# Altium project TMDX654GPEVM.PrjPcb (part 18 of 24)

## Sheet 39-VOLTAGE SUPERVISOR AND WKUP LEDs.SchDoc
size 513 x 386 mm
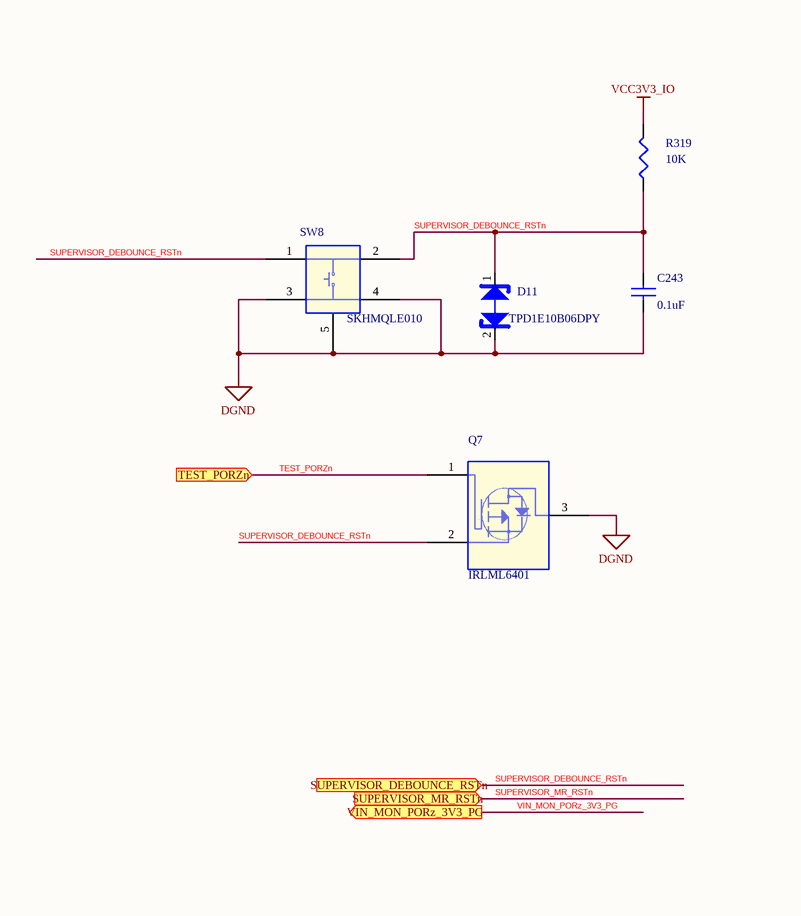
[diagram p72: 39-VOLTAGE SUPERVISOR AND WKUP LEDs.SchDoc, left]
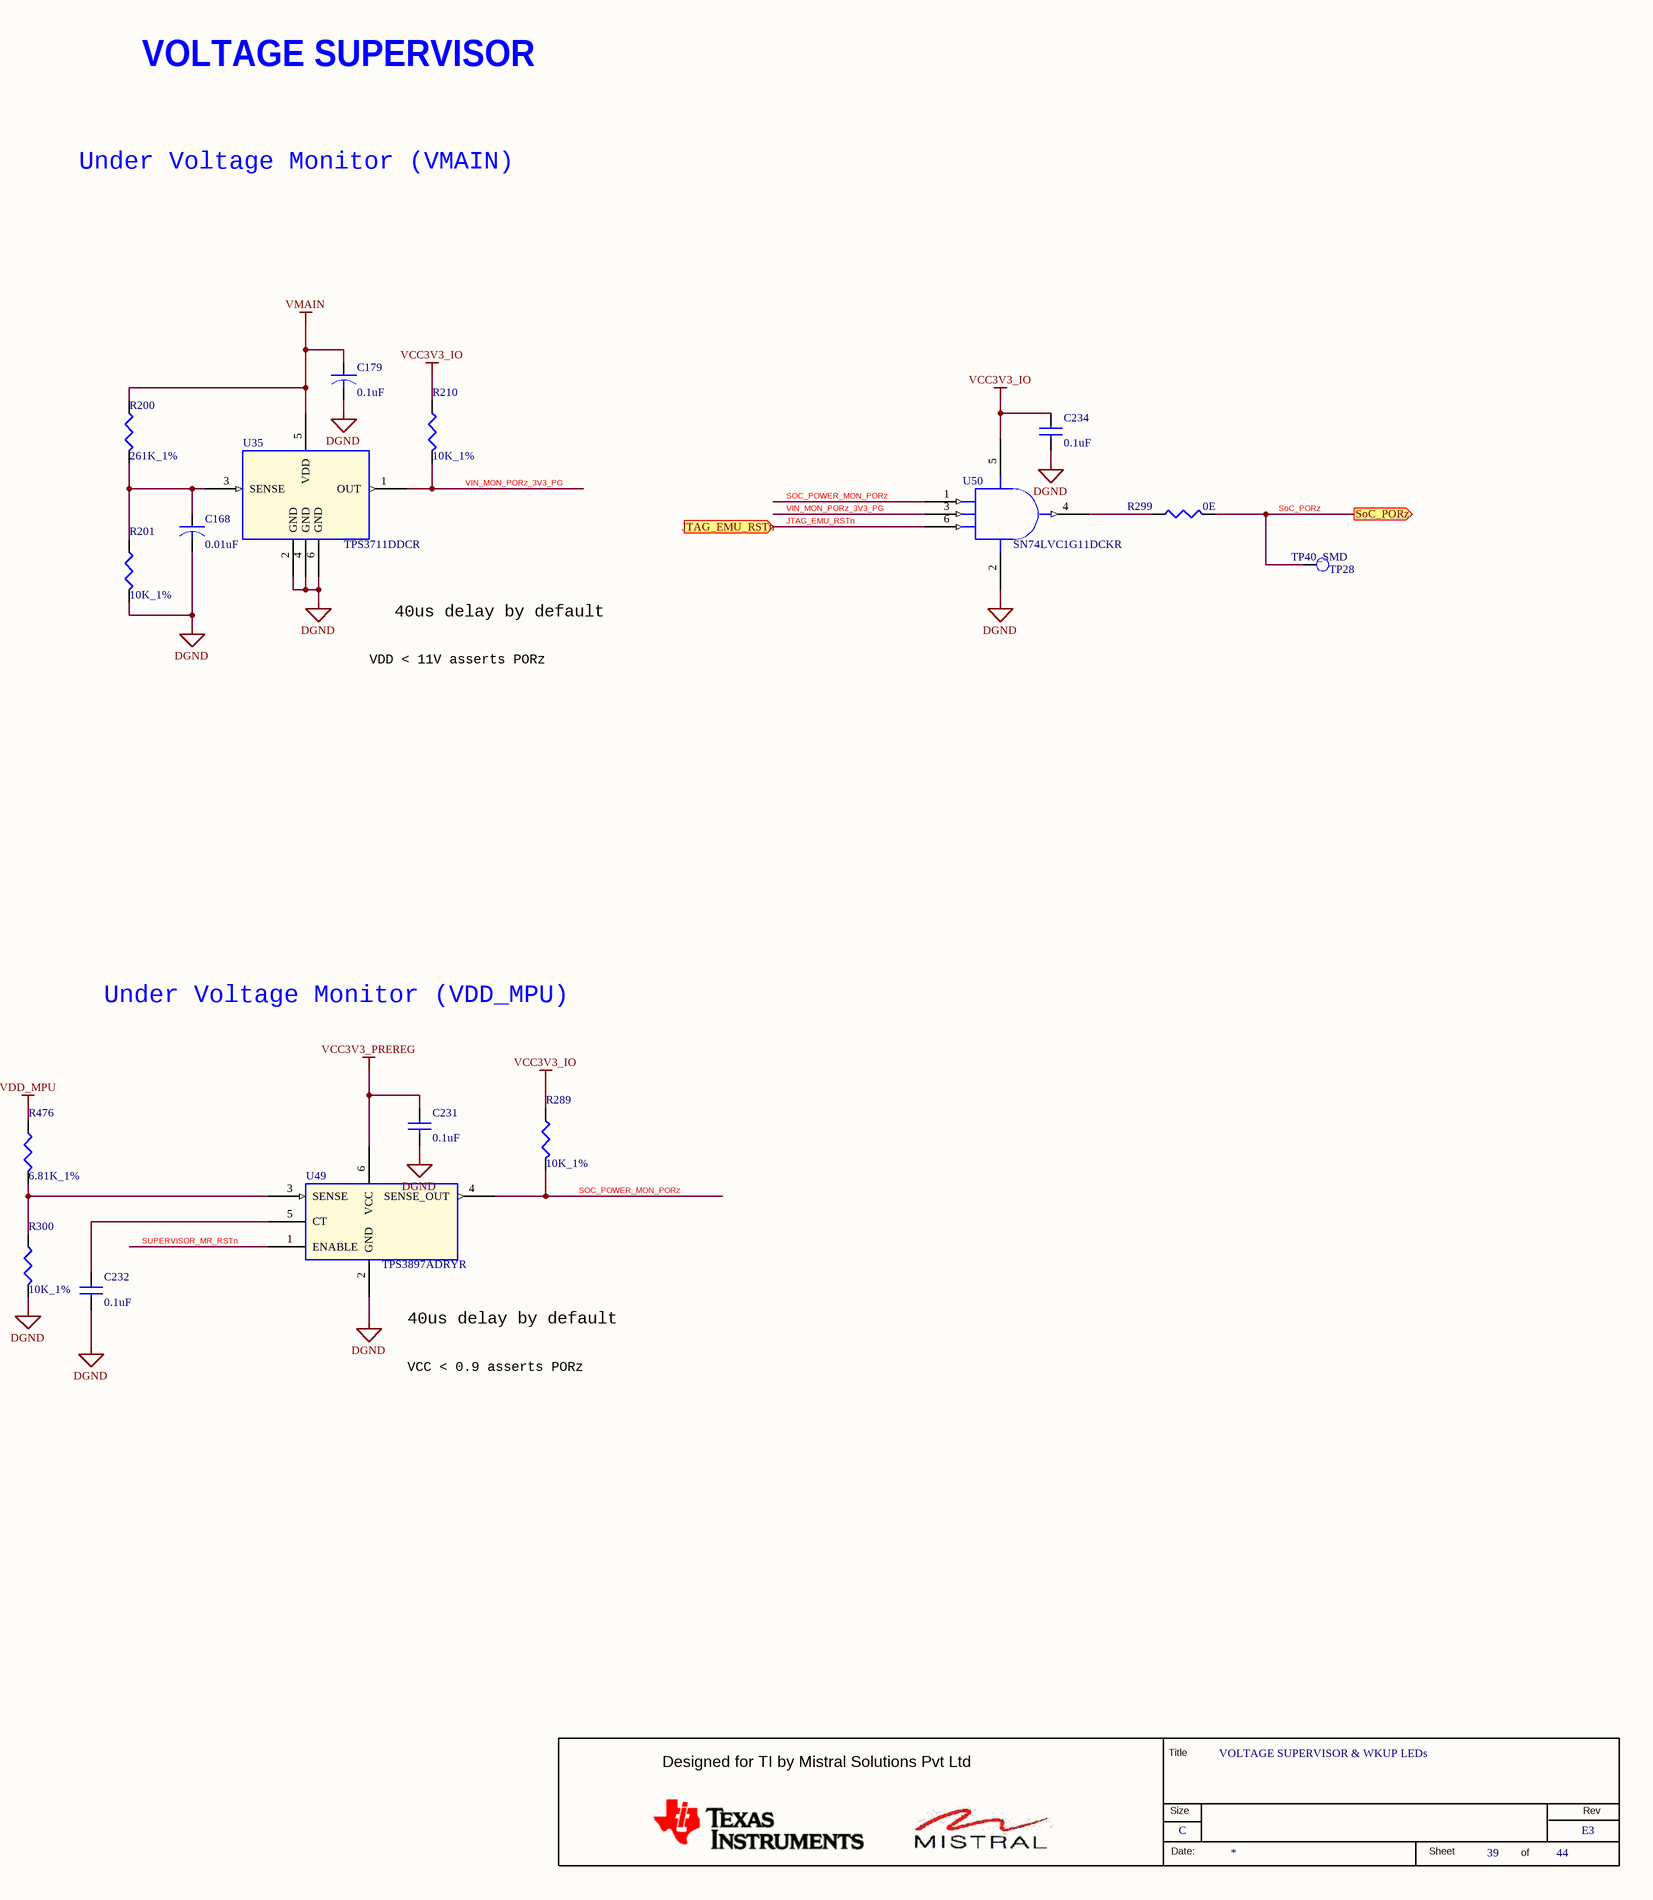
[diagram p73: 39-VOLTAGE SUPERVISOR AND WKUP LEDs.SchDoc, right]

### Parts
(Parts that share a designator on the sheet are numbered #1, #2 ... from top to bottom, then left to right.)
*#39  RevCode: E3  Title: VOLTAGE SUPERVISOR & WKUP LEDs  Page Size: C  Page Number: 39  Page Count: 44  (hidden comment: MISTRAL_TITLEBLK_CSIZE)  (graphical)
C168  0.01uF  [CAP0201_0-5]
C179  0.1uF  [CAP0603_1]
C231  0.1uF  [CAP0201_0-5]
C232  0.1uF  [CAP0201_0-5]
C234  0.1uF  [CAP0201_0-5]
C243  0.1uF  [CAP0201_0-5]
D11  TPD1E10B06DPY  [DIO_DFN0402]
Q7  IRLML6401  [TO_SOT23-123]
R200  261K_1%  [RES0402_0-5]
R201  10K_1%  [RES0402_0-5]
R210  10K_1%  [RES0402_0-5]
R289  10K_1%  [RES0402_0-5]
R299  0E  [RES0402_0-5]
R300  10K_1%  [RES0402_0-5]
R319  10K  [RES0402_0-5]
R476  6.81K_1%  [RES0402_0-5]
SW8  SKHMQLE010  [SW4_SKHMQLE010_240X260_SMD_3-1]
TP28  TP40_SMD  [TP40_SMD]
U35  TPS3711DDCR  [SOT23-6_1-1]
U49  TPS3897ADRYR  [SON6_19-68_40X60_0-6]
U50  SN74LVC1G11DCKR  [SC70-6]

### Ports
JTAG_EMU_RSTn (in), SoC_PORz (out), SUPERVISOR_DEBOUNCE_RSTn (in), SUPERVISOR_MR_RSTn (in), TEST_PORZn (in), VIN_MON_PORz_3V3_PG (out)

### Nets
DGND: C168.2 C179.2 C231.2 C232.2 C234.2 C243.2 D11.2(A) Q7.3(D) R201.2 R300.2 SW8.3 SW8.4 SW8.5(GND) U35.2(GND) U35.4(GND) U35.6(GND) U49.2(GND) U50.2(GND)
VCC3V3_IO: C234.1 R210.1 R289.1 R319.2 U50.5(VCC)
VCC3V3_PREREG: C231.1 U49.6(VCC)
VDD_MPU: R476.1
VMAIN: C179.1 R200.1 U35.5(VDD)
JTAG_EMU_RSTn: U50.6(C) ; port JTAG_EMU_RSTn
SoC_PORz: R299.2 TP28.1(TP) ; port SoC_PORz
SOC_POWER_MON_PORz: R289.2 U49.4(SENSE_OUT) U50.1(A)
SUPERVISOR_DEBOUNCE_RSTn: C243.1 D11.1(K) Q7.2(S) R319.1 SW8.1 SW8.2 ; port SUPERVISOR_DEBOUNCE_RSTn
SUPERVISOR_MR_RSTn: U49.1(ENABLE) ; port SUPERVISOR_MR_RSTn
TEST_PORZn: Q7.1(G) ; port TEST_PORZn
VIN_MON_PORz_3V3_PG: R210.2 U35.1(OUT) U50.3(B) ; port VIN_MON_PORz_3V3_PG
NetC168_1: C168.1 R200.2 R201.1 U35.3(SENSE)
NetC232_1: C232.1 U49.5(CT)
NetR299_1: R299.1 U50.4(Y)
NetR300_1: R300.1 R476.2 U49.3(SENSE)

### Notes on the sheet
- VOLTAGE SUPERVISOR
- Under Voltage Monitor (VMAIN)
- 40us delay by default
- VDD < 11V asserts PORz
- Under Voltage Monitor (VDD_MPU)
- VCC < 0.9 asserts PORz
- (in symbol MISTRAL_TITLEBLK_CSIZE) Title; Designed for TI by Mistral Solutions Pvt Ltd; Size; Rev; Date:; Sheet; of

### Library data of the parts
*#39 = MISTRAL_TITLEBLK_CSIZE: Issue: 1.0; Page Create Date: March  8, 1995; Page Modify Date: *
C168 = CAP: CAP CERAMIC 0.01uF 25V 10% X5R 0201; Mistral Part No: 120018010007-R; Mfr_name: MURATA; Mfr_part_number: GRM033R61E103KA12J; Part_type: CAPACITORS\CERAMIC; Project: TI_MAXIE_CPB; Wattage: NA; Customs_HS_Code: 85322990; Custom_Duty: 15%; Library Ref: CAP; Tolerance: 10%; Voltage: 25V; Package: 0201; Distributor_name: DIGIKEY; Distributor_part_number: GRM033R61E103KA12J-ND; Height: 0.33MM; Weight: 0.33mg; Temperature: -55°C+85°C; Datasheet: Y:\MIS_DATABASE\DATASHEETS\CAPACITORS\GRM033R61E103KA12.PDF; Crtd /date: MANIRAJA/230118; Chkd/date: MANIRAJA/230118; MECHANICAL 3D STEP FILE: CAP0201_0-5; PCB Footprint: CAP0201_0-5
C179 = CAP_Dup1: CAP CERAMIC 0.1uF 50V 20% X7R 0603; Mistral Part No: 120018010021-R; Mfr_name: KEMET; Mfr_part_number: C0603C104M5RACTU; Part_type: CAPACITORS\CERAMIC; Project: TI_MAXIE_CPB; Wattage: NA; Customs_HS_Code: 85322990; Custom_Duty: 15%; Library Ref: CAP; MECHANICAL 3D STEP FILE: CAP0603_1; Tolerance: 20%; Voltage: 50V; Package: 0603; Distributor_name: DIGIKEY; Distributor_part_number: 399-7845-1-ND; Height: 0.95MM; Weight: 2mg; Temperature: -55°C+125°C; Datasheet: Y:\MIS_DATABASE\DATASHEETS\CAPACITORS\KEMET-X7R-SER.PDF; Crtd /date: MANIRAJA/240118; Chkd/date: MANIRAJA/240118; PCB Footprint: CAP0603_1
C231 = CAP_Dup4: CAP CERAMIC 0.1uF 16V 10% X5R 0201; Part_type: CAPACITORS\CERAMIC; Mfr_part_number: GRM033R61C104KE84J; Mfr_name: MURATA; Mistral Part No: 120009030072-R; Custom_Duty: 15%; Customs_HS_Code: 85322990; Wattage: NA; Project: TI_MAXIE_CPB; Library Ref: CAP; Chkd/date: MANIRAJA/120218; Crtd /date: MANIRAJA/120218; Datasheet: Y:\MIS_DATABASE\DATASHEETS\CAPACITORS\GRM033R61C104KE84.PDF; Weight: 0.33mg; Height: 0.33MM; Distributor_part_number: 490-16742-1-ND; Distributor_name: DIGIKEY; Package: 0201; Voltage: 16V; Tolerance: 10%; Temperature: -55°C+85°C; MECHANICAL 3D STEP FILE: CAP0201_0-5; PCB Footprint: CAP0201_0-5
C232 = CAP_Dup4: CAP CERAMIC 0.1uF 16V 10% X5R 0201; Part_type: CAPACITORS\CERAMIC; Mfr_part_number: GRM033R61C104KE84J; Mfr_name: MURATA; Mistral Part No: 120009030072-R; Custom_Duty: 15%; Customs_HS_Code: 85322990; Wattage: NA; Project: TI_MAXIE_CPB; NI_MARK: DNI; Library Ref: CAP; Chkd/date: MANIRAJA/120218; Crtd /date: MANIRAJA/120218; Datasheet: Y:\MIS_DATABASE\DATASHEETS\CAPACITORS\GRM033R61C104KE84.PDF; Weight: 0.33mg; Height: 0.33MM; Distributor_part_number: 490-16742-1-ND; Distributor_name: DIGIKEY; Package: 0201; Voltage: 16V; Tolerance: 10%; Temperature: -55°C+85°C; MECHANICAL 3D STEP FILE: CAP0201_0-5; PCB Footprint: CAP0201_0-5
C234 = CAP_Dup4: CAP CERAMIC 0.1uF 16V 10% X5R 0201; Mistral Part No: 120009030072-R; Mfr_name: MURATA; Mfr_part_number: GRM033R61C104KE84J; Part_type: CAPACITORS\CERAMIC; Project: TI_MAXIE_CPB; Wattage: NA; Customs_HS_Code: 85322990; Custom_Duty: 15%; Library Ref: CAP; Tolerance: 10%; Voltage: 16V; Package: 0201; Distributor_name: DIGIKEY; Distributor_part_number: 490-16742-1-ND; Height: 0.33MM; Weight: 0.33mg; Datasheet: Y:\MIS_DATABASE\DATASHEETS\CAPACITORS\GRM033R61C104KE84.PDF; Crtd /date: MANIRAJA/120218; Chkd/date: MANIRAJA/120218; Temperature: -55°C+85°C; MECHANICAL 3D STEP FILE: CAP0201_0-5; PCB Footprint: CAP0201_0-5
C243 = CAP_Dup5: as C160 on sheet 36-ETHERNET PHY CLOCK GENERATOR; Library Ref: CAP; PCB Footprint: CAP0201_0-5; MECHANICAL 3D STEP FILE: CAP0201_0-5; Chkd/date: MANIRAJA/120218; Crtd /date: MANIRAJA/120218; Datasheet: Y:\MIS_DATABASE\DATASHEETS\CAPACITORS\GRM033R61C104KE84.PDF; Temperature: -55°C+85°C; Weight: 0.33mg; Height: 0.33MM; Distributor_part_number: 490-16742-1-ND; Distributor_name: DIGIKEY; Package: 0201; Voltage: 16V; Tolerance: 10%
D11 = DIODE_PESD: DIODE 1CH ESD PROTECTION SMD(0402); Mistral Part No: 130014110022-R; Mfr_name: TEXAS INSTRUMENTS; Part_type: DIODE\MISC; Project: GALILEO_EVM; Tolerance: NA; Customs_HS_Code: 85423100; Custom_Duty: 15%; Library Ref: DIODE_PESD; Mfr_part_number: TPD1E10B06DPY; Voltage: NA; Wattage: NA; Package: SMD; Distributor_name: DIGIKEY; Distributor_part_number: 296-30406-1-ND; Height: 0.45MM; Weight: NA; Temperature: -40°C+125°C; Datasheet: Y:\MIS_DATABASE\DATASHEETS\ICS\INTERFACE\TPD1E10B06.PDF; Crtd /date: VASANTHA/181114; Chkd/date: USMAN/021214; PCB Footprint: DIO_DFN0402
Q7 = MOSFET_IRLML6401TR: TRANSISTOR MOSFET P-CHANNEL SOT23-3; Part_type: TRANSISTOR\MOSFET; Mfr_part_number: IRLML6401TRPBF; Mfr_name: IRF; Mistral Part No: 130009031213-P; Remarks: Part# replaced from “IRLML6401TR” to “IRLML6401TRPBF” making as a Pb-free part. (BAVISH/220311).; Custom_Duty: 15%; Customs_HS_Code: 85412900; Wattage: NA; Project: G4_SVGA; Library Ref: MOSFET_IRLML6401TR; RoHS: Pb-Free; Chkd/date: SHREESHAIL/020206; Crtd /date: MAZHAR/040505; Datasheet: Y:\MIS_DATABASE\DATASHEETS\DISCRETES\TRANSISTORS_FETS\IRLML6401.PDF; Temperature: -55°C+150°C; Weight: NA; Height: 1.11MM; Distributor_part_number: IRLML6401PBFCT-ND; Distributor_name: DIGIKEY; Package: SOT23-3; Voltage: NA; Tolerance: NA; PCB Footprint: TO_SOT23-123
R200 = RESISTOR_Dup5: RES 261K 1/16W 1% 0402; Mistral Part No: 110015080042-R; Mfr_name: YAGEO AMERICA; Mfr_part_number: RC0402FR-07261KL; Part_type: RESISTORS\FIXED; Project: OCTBTS3600; Voltage: NA; Customs_HS_Code: 85332119; Custom_Duty: 15%; Library Ref: RESISTOR; PCB Footprint: RES0402_0-5; Tolerance: 1%; Wattage: 1/16W; Package: 0402; Distributor_name: DIGIKEY; Distributor_part_number: 311-261KLRCT-ND; Height: 0.40MM; Weight: 0.65mg; Temperature: -55°C+155°C; Datasheet: Y:\MIS_DATABASE\DATASHEETS\RESISTORS\YAGEO.PDF; Crtd /date: JEBRAN/250815; Chkd/date: MANIRAJA/101017; MECHANICAL 3D STEP FILE: RES0402_0-5
R201 = RESISTOR_Dup5: RES 10K 1/16W 1% 0402; Mistral Part No: 110009030220-P; Mfr_name: YAGEO AMERICA; Mfr_part_number: RC0402FR-0710KL; Part_type: RESISTORS\FIXED; Project: VOCERA; Voltage: NA; Customs_HS_Code: 85332119; Custom_Duty: 15%; Footprint Path: Y:\MIS_DATABASE\Library\ALTIUM_TOOL\PCB_FOOTPRINTS\Altium_Footprint_Lib.PcbLib; Library Path: Y:\MIS_DATABASE\Library\ALTIUM_TOOL\SCHEMATICS_PARTS\MS_DISCRETE_Library.schlib; Footprint Ref: RES0402_0-5; Library Ref: RESISTOR; PCB Footprint: RES0402_0-5; MECHANICAL 3D STEP FILE: RES0402_0-5; Tolerance: 1%; Wattage: 1/16W; Package: 0402; Distributor_name: DIGIKEY; Distributor_part_number: 311-10.0KLRTR-ND; Height: 0.40MM; Weight: 0.65mg; Temperature: -55°C+155°C; Datasheet: Y:\MIS_DATABASE\DATASHEETS\RESISTORS\YAGEO-RC0402.PDF; Crtd /date: GEETHA/290506; Chkd/date: VASANTHA/201216; RoHS: Pb-Free
R210 R289 R300 = RESISTOR_Dup4: RES 10K 1/16W 1% 0402; Part_type: RESISTORS\FIXED; Mfr_part_number: RC0402FR-0710KL; Mfr_name: YAGEO AMERICA; Mistral Part No: 110009030220-P; Custom_Duty: 15%; Customs_HS_Code: 85332119; Project: VOCERA; Voltage: NA; Footprint Path: Y:\MIS_DATABASE\Library\ALTIUM_TOOL\PCB_FOOTPRINTS\Altium_Footprint_Lib.PcbLib; Library Path: Y:\MIS_DATABASE\Library\ALTIUM_TOOL\SCHEMATICS_PARTS\MS_DISCRETE_Library.schlib; Footprint Ref: RES0402_0-5; Library Ref: RESISTOR; PCB Footprint: RES0402_0-5; RoHS: Pb-Free; Chkd/date: VASANTHA/201216; Crtd /date: GEETHA/290506; Datasheet: Y:\MIS_DATABASE\DATASHEETS\RESISTORS\YAGEO-RC0402.PDF; Height: 0.40MM; Distributor_part_number: 311-10.0KLRTR-ND; Distributor_name: DIGIKEY; Package: 0402; Wattage: 1/16W; Tolerance: 1%; Weight: 0.65mg; Temperature: -55°C+155°C; MECHANICAL 3D STEP FILE: RES0402_0-5
R299 = RESISTOR_Dup5: RES 0E 1/16W 0402; Part_type: RESISTORS\FIXED; Mfr_part_number: CRCW04020000Z0ED; Mfr_name: VISHAY; Mistral Part No: 110010080019-P; Custom_Duty: 15%; Customs_HS_Code: 85332119; Voltage: NA; Project: PB_BUGBASE; Footprint Path: Y:\MIS_DATABASE\Library\ALTIUM_TOOL\PCB_FOOTPRINTS\Altium_Footprint_Lib.PcbLib; Library Path: Y:\MIS_DATABASE\Library\ALTIUM_TOOL\SCHEMATICS_PARTS\MS_DISCRETE_Library.schlib; Footprint Ref: RES0402_0-5; Library Ref: RESISTOR; PCB Footprint: RES0402_0-5; MECHANICAL 3D STEP FILE: RES0402_0-5; RoHS: Pb-Free; Chkd/date: VASANTHA/201216; Crtd /date: MUDDU/190810; Datasheet: Y:\MIS_DATABASE\DATASHEETS\RESISTORS\CRCW0603.PDF; Temperature: -55°C+155°C; Weight: 0.65g/1000pcs; Height: 0.40MM; Distributor_part_number: 541-0.0JCT-ND; Distributor_name: DIGIKEY; Package: 0402; Wattage: 1/16W; Tolerance: NA
R319 = RESISTOR_Dup5: as R189 on sheet 36-ETHERNET PHY CLOCK GENERATOR; Footprint Path: Y:\MIS_DATABASE\Library\ALTIUM_TOOL\PCB_FOOTPRINTS\Altium_Footprint_Lib.PcbLib; Library Path: Y:\MIS_DATABASE\Library\ALTIUM_TOOL\SCHEMATICS_PARTS\MS_DISCRETE_Library.schlib; Footprint Ref: RES0402_0-5; Library Ref: RESISTOR; MECHANICAL 3D STEP FILE: RES0402_0-5; RoHS: Pb-Free; Chkd/date: VASANTHA/061216; Crtd /date: MAZHAR/230805; Datasheet: Y:\MIS_DATABASE\DATASHEETS\RESISTORS\YAGEO-RC0402.PDF; Temperature: -55°C+155°C; Weight: 0.65mg; Height: 0.40MM; Distributor_part_number: 311-10KJRCT-ND; Distributor_name: DIGIKEY; Package: 0402; Wattage: 1/16W; Tolerance: 5%; PCB Footprint: RES0402_0-5
R476 = RESISTOR: RES 6.81K 1/16W 1% 0402; Part_type: RESISTORS\FIXED; Mfr_part_number: RC0402FR-076K81L; Mfr_name: YAGEO AMERICA; Mistral Part No: 110017100003-R; Custom_Duty: 15%; Customs_HS_Code: 85332119; Voltage: NA; Project: TI_MAXIE_CPB; Library Ref: RESISTOR; PCB Footprint: RES0402_0-5; MECHANICAL 3D STEP FILE: RES0402_0-5; Chkd/date: VASANTHA/181017; Crtd /date: VASANTHA/181017; Datasheet: Y:\MIS_DATABASE\DATASHEETS\RESISTORS\YAGEO-RC0402.PDF; Temperature: -55°C+155°C; Weight: NA; Height: 0.40MM; Distributor_part_number: 311-6.81KLRCT-ND; Distributor_name: DIGIKEY; Package: 0402; Wattage: 1/16W; Tolerance: 1%
SW8 = SW4_SKHUPLE010: SWITCH TACTILE SPST ST SMD; Part_type: ELECTRO-MECHANICAL\SWITCH; Mfr_name: ALPS; Mistral Part No: 130017100007-R; Custom_Duty: 24%; Customs_HS_Code: 85369090; Wattage: NA; Project: TI_MAXIE_CPB; Library Ref: SW4_SKHUPLE010; MECHANICAL 3D STEP FILE: SW4_SKHMQLE010_240X260_SMD_3-1; Chkd/date: MANIRAJA/051017; Crtd /date: MANIRAJA/051017; Datasheet: Y:\MIS_DATABASE\DATASHEETS\MISC\SWITCHES\SKHMQLE010.PDF; Temperature: -30°C+85°C; Weight: NA; Height: 3.10MM; Distributor_part_number: 688-SKHMQLE010; Distributor_name: MOUSER; Package: SMD; Voltage: NA; Tolerance: NA; Mfr_part_number: SKHMQLE010; PCB Footprint: SW4_SKHMQLE010_240X260_SMD_3-1
TP28 = TESTPOINT: TESTPOINT CIR 40 SMD; Mfr_name: LOCAL; Mistral Part No: 130009030933; Project: RAINIER-3; Tolerance: NA; NI_MARK: DNI; RoHS: NA; Footprint Ref: TP40_SMD; Library Ref: TESTPOINT; Chkd/date: MAZHAR/190505; Crtd /date: MAZHAR/190505; Height: NA; Distributor_part_number: NA; Distributor_name: NA; Package: SMD; Part_type: TESTPOINT; Mfr_part_number: TP40_SMD; Voltage: NA; Wattage: NA; Weight: NA; Temperature: NA; Datasheet: NA; MECHANICAL 3D STEP FILE: NA; Library Path: Y:\MIS_DATABASE\Library\ALTIUM_TOOL\SCHEMATICS_PARTS\MS_DISCRETE_Library.schlib; Footprint Path: Y:\MIS_DATABASE\Library\ALTIUM_TOOL\PCB_FOOTPRINTS\Altium_Footprint_Lib.PcbLib; PCB Footprint: TP40_SMD
U35 = TPS3711DDCR_SOT23-6: IC 36V VOLTAGE DETECTOR SOT23-6; Part_type: ICS\POWER\MANAGEMENT; Mfr_name: TEXAS INSTRUMENTS; Mistral Part No: 142017100008-R; Custom_Duty: 15%; Customs_HS_Code: 85423100; Wattage: NA; Project: TI_MAXIE_CPB; Library Ref: TPS3711DDCR_SOT23-6; PCB Footprint: SOT23-6_1-1; MECHANICAL 3D STEP FILE: SOT23-6_1-1; Chkd/date: MANIRAJA/091017; Crtd /date: MANIRAJA/091017; Datasheet: Y:\MIS_DATABASE\DATASHEETS\ICS\POWER\TPS3711D.PDF; Temperature: -40°C+125°C; Weight: 30mg; Height: 1.10MM; Distributor_part_number: 296-43278-1-ND; Distributor_name: DIGIKEY; Package: SOT23-6; Voltage: NA; Tolerance: NA; Mfr_part_number: TPS3711DDCR
U49 = TPS3897ADRYR_SON6: IC 1-CH ADJ VOLTAGE MONITOR SON6; Mistral Part No: 142017100007-R; Mfr_name: TEXAS INSTRUMENTS; Part_type: ICS\POWER\MANAGEMENT; Project: TI_MAXIE_CPB; Tolerance: NA; Customs_HS_Code: 85423100; Custom_Duty: 15%; Library Ref: TPS3897ADRYR_SON6; PCB Footprint: SON6_19-68_40X60_0-6; Mfr_part_number: TPS3897ADRYR; Voltage: NA; Wattage: NA; Package: SON6; Distributor_name: DIGIKEY; Distributor_part_number: 296-29810-1-ND; Height: 0.60MM; Weight: NA; Temperature: -40°C+125°C; Datasheet: Y:\MIS_DATABASE\DATASHEETS\ICS\POWER\TPS389X.PDF; Crtd /date: MANIRAJA/091017; Chkd/date: MANIRAJA/091017; MECHANICAL 3D STEP FILE: SON6_19-68_40X60_0-6
U50 = SN74LVC1G11DCKR_SC70-6: IC SINGLE 3-INPUT POSITIVE-AND GATE SC70-6; Mistral Part No: 141009030230-R; Mfr_name: TEXAS INSTRUMENTS; Part_type: ICS\DIGITAL\GATES; Project: VOCERA; Customs_HS_Code: 85423100; Custom_Duty: 15%; Library Ref: SN74LVC1G11DCKR_SC70-6; Mfr_part_number: SN74LVC1G11DCKR; Package: SC70-6; Distributor_name: DIGIKEY; Distributor_part_number: 296-18066-1-ND; Height: 1.10MM; Datasheet: Y:\MIS_DATABASE\DATASHEETS\ICS\DIGITAL\GATES\SN74LVC1G.PDF; Crtd /date: MAZHAR/150506; Chkd/date: SHREESHAIL/220506; RoHS: Sb/ Br FREE; PCB Footprint: SC70-6